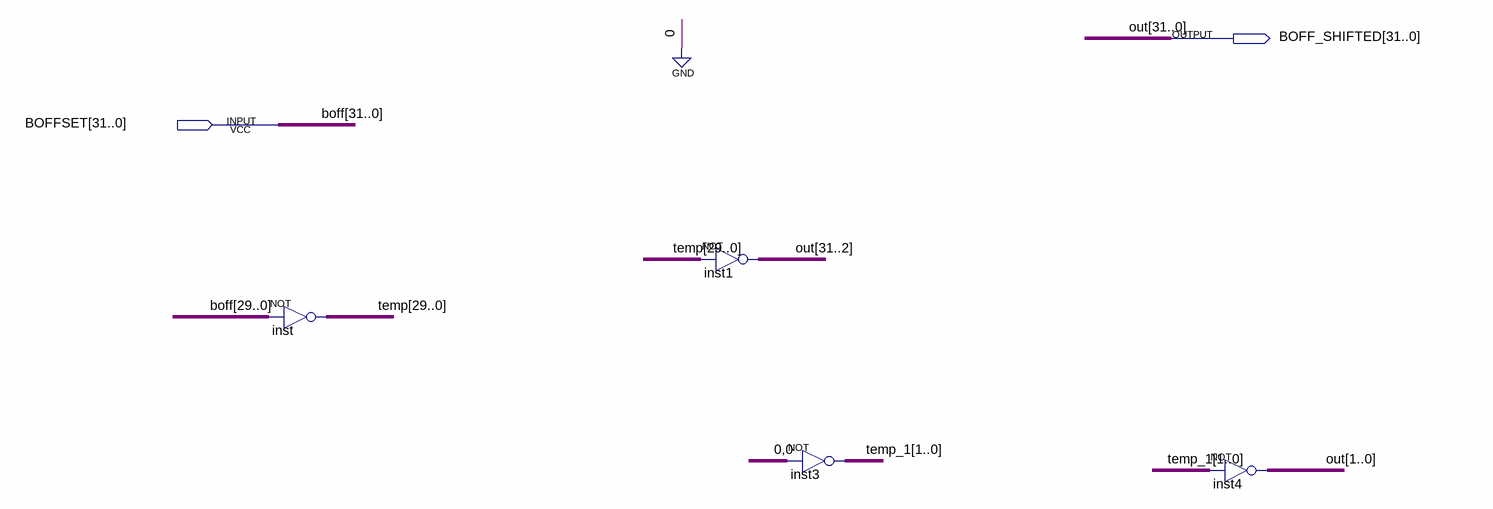
[diagram p0: schematic sheet]
// Quartus schematic offset_shifter.bdf as structural Verilog: 4 symbols, 2 pins
module offset_shifter (
  input  [31:0] BOFFSET,
  output [31:0] BOFF_SHIFTED
);

  wire [1:0] temp_1;
  wire [29:0] temp;

  assign temp = ~BOFFSET[29:0];  // NOT inst, 30 bits wide
  assign BOFF_SHIFTED[31:2] = ~temp;  // NOT inst1, 30 bits wide
  assign temp_1 = ~2'b00;  // NOT inst3, 2 bits wide
  assign BOFF_SHIFTED[1:0] = ~temp_1;  // NOT inst4, 2 bits wide

  // Other names for the same wires on the sheet: boff[31:0] = BOFFSET; out[31:0] = BOFF_SHIFTED
endmodule
